# Altium schematic sheet 11_Miscellaneous.SchDoc
size A3; Engineer: Mehmet Selcuk Yayan; Organization: Procenne
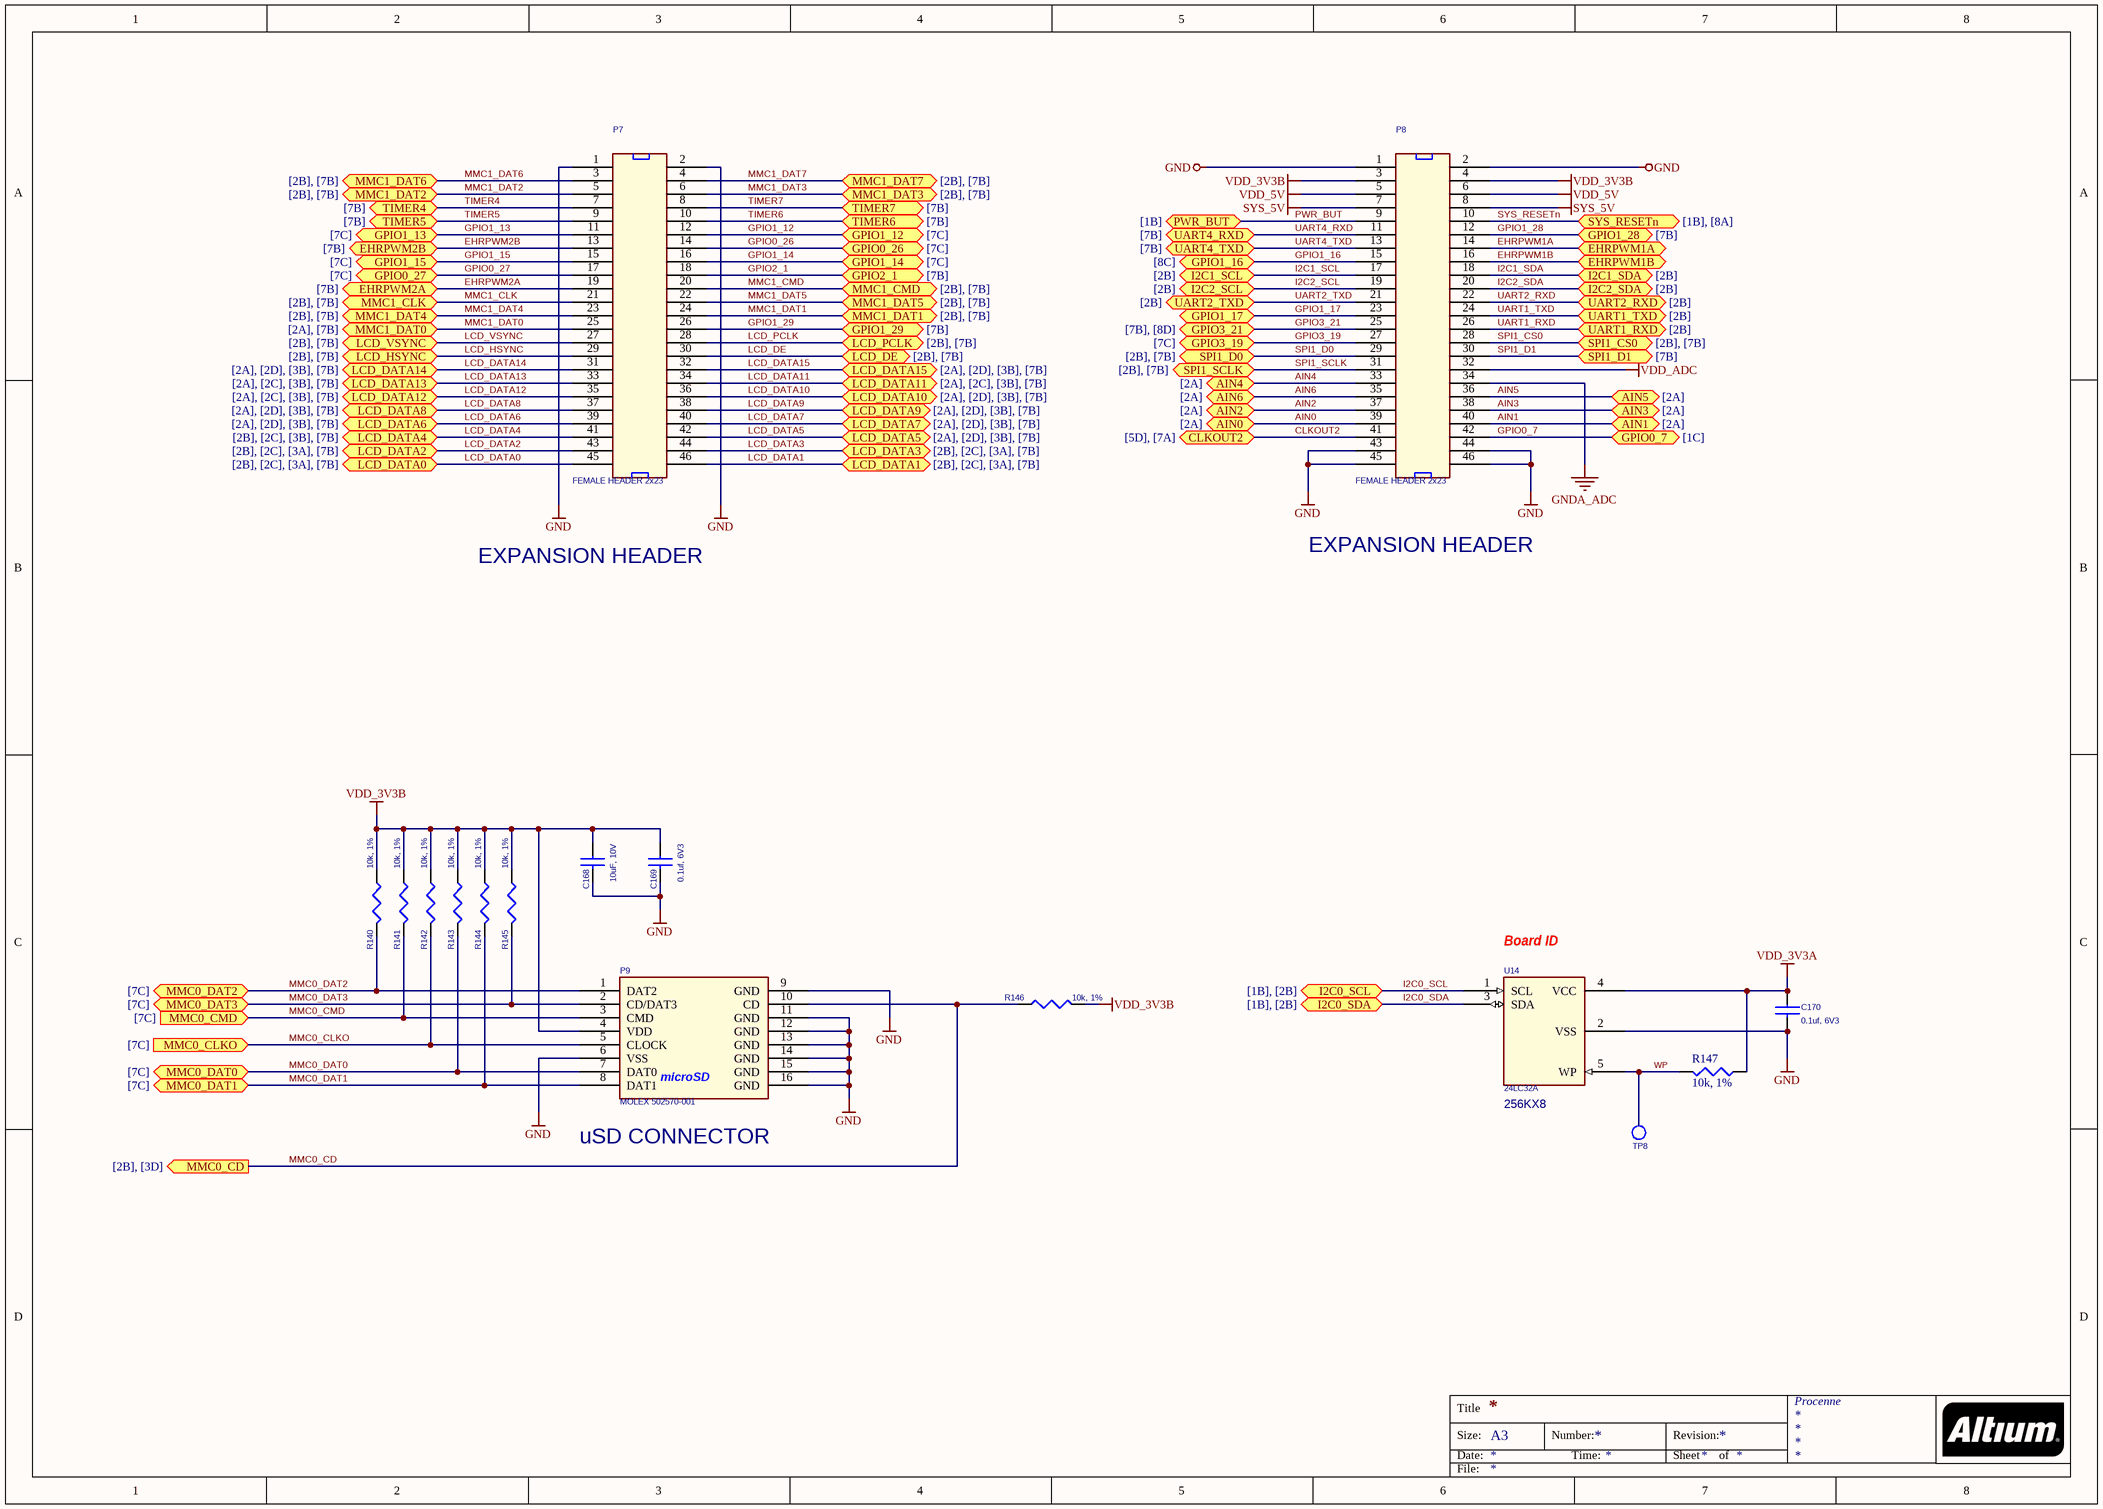
[diagram p0: 11_Miscellaneous.SchDoc]

## Parts
C168  10uF, 10V  [805]
C169  0.1uf, 6V3  [402]
C170  0.1uf, 6V3  [402]
P7  FEMALE HEADER 2x23  [HEADER23X2]
P8  FEMALE HEADER 2x23  [HEADER23X2]
P9  MOLEX 502570-001  [SD-MICRO-SCHA5B0300]
R140  10k, 1%  [402]
R141  10k, 1%  [402]
R142  10k, 1%  [402]
R143  10k, 1%  [402]
R144  10k, 1%  [402]
R145  10k, 1%  [402]
R146  10k, 1%  [402]
R147  10k, 1%  [402]
TP8  TESTPT1  [tp1-8040]  (value not drawn)  (no BOM)
U14  24LC32A  [SOT23-5]

## Ports
AIN0 (bidir, see [2A]), AIN1 (bidir, see [2A]), AIN2 (bidir, see [2A]), AIN3 (bidir, see [2A]), AIN4 (bidir, see [2A]), AIN5 (bidir, see [2A]), AIN6 (bidir, see [2A]), CLKOUT2 (bidir, see [5D], [7A]), EHRPWM1A (bidir), EHRPWM1B (bidir), EHRPWM2A (bidir, see [7B]), EHRPWM2B (bidir, see [7B]), GPIO0_7 (bidir, see [1C]), GPIO0_26 (bidir, see [7C]), GPIO0_27 (bidir, see [7C]), GPIO1_12 (bidir, see [7C]), GPIO1_13 (bidir, see [7C]), GPIO1_14 (bidir, see [7C]), GPIO1_15 (bidir, see [7C]), GPIO1_16 (bidir, see [8C]), GPIO1_17 (bidir), GPIO1_28 (bidir, see [7B]), GPIO1_29 (bidir, see [7B]), GPIO2_1 (bidir, see [7B]), GPIO3_19 (bidir, see [7C]), GPIO3_21 (bidir, see [7B], [8D]), I2C0_SCL (bidir, see [1B], [2B]), I2C0_SDA (bidir, see [1B], [2B]), I2C1_SCL (bidir, see [2B]), I2C1_SDA (bidir, see [2B]), I2C2_SCL (bidir, see [2B]), I2C2_SDA (bidir, see [2B]), LCD_DATA0 (bidir, see [2B], [2C], [3A], [7B]), LCD_DATA1 (bidir, see [2B], [2C], [3A], [7B]), LCD_DATA2 (bidir, see [2B], [2C], [3A], [7B]), LCD_DATA3 (bidir, see [2B], [2C], [3A], [7B]), LCD_DATA4 (bidir, see [2B], [2C], [3B], [7B]), LCD_DATA5 (bidir, see [2A], [2D], [3B], [7B]), LCD_DATA6 (bidir, see [2A], [2D], [3B], [7B]), LCD_DATA7 (bidir, see [2A], [2D], [3B], [7B]), LCD_DATA8 (bidir, see [2A], [2D], [3B], [7B]), LCD_DATA9 (bidir, see [2A], [2D], [3B], [7B]), LCD_DATA10 (bidir, see [2A], [2D], [3B], [7B]), LCD_DATA11 (bidir, see [2A], [2C], [3B], [7B]), LCD_DATA12 (bidir, see [2A], [2C], [3B], [7B]), LCD_DATA13 (bidir, see [2A], [2C], [3B], [7B]), LCD_DATA14 (bidir, see [2A], [2D], [3B], [7B]), LCD_DATA15 (bidir, see [2A], [2D], [3B], [7B]), LCD_DE (bidir, see [2B], [7B]), LCD_HSYNC (bidir, see [2B], [7B]), LCD_PCLK (bidir, see [2B], [7B]), LCD_VSYNC (bidir, see [2B], [7B]), MMC0_CD (out, see [2B], [3D]), MMC0_CLKO (in, see [7C]), MMC0_CMD (in, see [7C]), MMC0_DAT0 (bidir, see [7C]), MMC0_DAT1 (bidir, see [7C]), MMC0_DAT2 (bidir, see [7C]), MMC0_DAT3 (bidir, see [7C]), MMC1_CLK (bidir, see [2B], [7B]), MMC1_CMD (bidir, see [2B], [7B]), MMC1_DAT0 (bidir, see [2A], [7B]), MMC1_DAT1 (bidir, see [2B], [7B]), MMC1_DAT2 (bidir, see [2B], [7B]), MMC1_DAT3 (bidir, see [2B], [7B]), MMC1_DAT4 (bidir, see [2B], [7B]), MMC1_DAT5 (bidir, see [2B], [7B]), MMC1_DAT6 (bidir, see [2B], [7B]), MMC1_DAT7 (bidir, see [2B], [7B]), PWR_BUT (bidir, see [1B]), SPI1_CS0 (bidir, see [2B], [7B]), SPI1_D0 (bidir, see [2B], [7B]), SPI1_D1 (bidir, see [7B]), SPI1_SCLK (bidir, see [2B], [7B]), SYS_RESETn (bidir, see [1B], [8A]), TIMER4 (bidir, see [7B]), TIMER5 (bidir, see [7B]), TIMER6 (bidir, see [7B]), TIMER7 (bidir, see [7B]), UART1_RXD (bidir, see [2B]), UART1_TXD (bidir, see [2B]), UART2_RXD (bidir, see [2B]), UART2_TXD (bidir, see [2B]), UART4_RXD (bidir, see [7B]), UART4_TXD (bidir, see [7B])

## Nets
GND: C168.2 C169.2 C170.2 P7.1 P7.2 P8.1 P8.2 P8.43 P8.44 P8.45 P8.46 P9.6(VSS) P9.9(GND) P9.11(GND) P9.12(GND) P9.13(GND) P9.14(GND) P9.15(GND) P9.16(GND) U14.2(VSS)
GNDA_ADC: P8.34
SYS_5V: P8.7 P8.8
VDD_3V3A: C170.1 R147.1 U14.4(VCC)
VDD_3V3B: C168.1 C169.1 P8.3 P8.4 P9.4(VDD) R140.1 R141.1 R142.1 R143.1 R144.1 R145.1 R146.2
VDD_5V: P8.5 P8.6
VDD_ADC: P8.32
AIN0: P8.39 ; port AIN0
AIN1: P8.40 ; port AIN1
AIN2: P8.37 ; port AIN2
AIN3: P8.38 ; port AIN3
AIN4: P8.33 ; port AIN4
AIN5: P8.36 ; port AIN5
AIN6: P8.35 ; port AIN6
CLKOUT2: P8.41 ; port CLKOUT2
EHRPWM1A: P8.14 ; port EHRPWM1A
EHRPWM1B: P8.16 ; port EHRPWM1B
EHRPWM2A: P7.19 ; port EHRPWM2A
EHRPWM2B: P7.13 ; port EHRPWM2B
GPIO0_7: P8.42 ; port GPIO0_7
GPIO0_26: P7.14 ; port GPIO0_26
GPIO0_27: P7.17 ; port GPIO0_27
GPIO1_12: P7.12 ; port GPIO1_12
GPIO1_13: P7.11 ; port GPIO1_13
GPIO1_14: P7.16 ; port GPIO1_14
GPIO1_15: P7.15 ; port GPIO1_15
GPIO1_16: P8.15 ; port GPIO1_16
GPIO1_17: P8.23 ; port GPIO1_17
GPIO1_28: P8.12 ; port GPIO1_28
GPIO1_29: P7.26 ; port GPIO1_29
GPIO2_1: P7.18 ; port GPIO2_1
GPIO3_19: P8.27 ; port GPIO3_19
GPIO3_21: P8.25 ; port GPIO3_21
I2C0_SCL: U14.1(SCL) ; port I2C0_SCL
I2C0_SDA: U14.3(SDA) ; port I2C0_SDA
I2C1_SCL: P8.17 ; port I2C1_SCL
I2C1_SDA: P8.18 ; port I2C1_SDA
I2C2_SCL: P8.19 ; port I2C2_SCL
I2C2_SDA: P8.20 ; port I2C2_SDA
LCD_DATA0: P7.45 ; port LCD_DATA0
LCD_DATA1: P7.46 ; port LCD_DATA1
LCD_DATA2: P7.43 ; port LCD_DATA2
LCD_DATA3: P7.44 ; port LCD_DATA3
LCD_DATA4: P7.41 ; port LCD_DATA4
LCD_DATA5: P7.42 ; port LCD_DATA5
LCD_DATA6: P7.39 ; port LCD_DATA6
LCD_DATA7: P7.40 ; port LCD_DATA7
LCD_DATA8: P7.37 ; port LCD_DATA8
LCD_DATA9: P7.38 ; port LCD_DATA9
LCD_DATA10: P7.36 ; port LCD_DATA10
LCD_DATA11: P7.34 ; port LCD_DATA11
LCD_DATA12: P7.35 ; port LCD_DATA12
LCD_DATA13: P7.33 ; port LCD_DATA13
LCD_DATA14: P7.31 ; port LCD_DATA14
LCD_DATA15: P7.32 ; port LCD_DATA15
LCD_DE: P7.30 ; port LCD_DE
LCD_HSYNC: P7.29 ; port LCD_HSYNC
LCD_PCLK: P7.28 ; port LCD_PCLK
LCD_VSYNC: P7.27 ; port LCD_VSYNC
MMC0_CD: P9.10(CD) R146.1 ; port MMC0_CD
MMC0_CLKO: P9.5(CLOCK) R142.2 ; port MMC0_CLKO
MMC0_CMD: P9.3(CMD) R141.2 ; port MMC0_CMD
MMC0_DAT0: P9.7(DAT0) R143.2 ; port MMC0_DAT0
MMC0_DAT1: P9.8(DAT1) R144.2 ; port MMC0_DAT1
MMC0_DAT2: P9.1(DAT2) R140.2 ; port MMC0_DAT2
MMC0_DAT3: P9.2(CD/DAT3) R145.2 ; port MMC0_DAT3
MMC1_CLK: P7.21 ; port MMC1_CLK
MMC1_CMD: P7.20 ; port MMC1_CMD
MMC1_DAT0: P7.25 ; port MMC1_DAT0
MMC1_DAT1: P7.24 ; port MMC1_DAT1
MMC1_DAT2: P7.5 ; port MMC1_DAT2
MMC1_DAT3: P7.6 ; port MMC1_DAT3
MMC1_DAT4: P7.23 ; port MMC1_DAT4
MMC1_DAT5: P7.22 ; port MMC1_DAT5
MMC1_DAT6: P7.3 ; port MMC1_DAT6
MMC1_DAT7: P7.4 ; port MMC1_DAT7
PWR_BUT: P8.9 ; port PWR_BUT
SPI1_CS0: P8.28 ; port SPI1_CS0
SPI1_D0: P8.29 ; port SPI1_D0
SPI1_D1: P8.30 ; port SPI1_D1
SPI1_SCLK: P8.31 ; port SPI1_SCLK
SYS_RESETn: P8.10 ; port SYS_RESETn
TIMER4: P7.7 ; port TIMER4
TIMER5: P7.9 ; port TIMER5
TIMER6: P7.10 ; port TIMER6
TIMER7: P7.8 ; port TIMER7
UART1_RXD: P8.26 ; port UART1_RXD
UART1_TXD: P8.24 ; port UART1_TXD
UART2_RXD: P8.22 ; port UART2_RXD
UART2_TXD: P8.21 ; port UART2_TXD
UART4_RXD: P8.11 ; port UART4_RXD
UART4_TXD: P8.13 ; port UART4_TXD
WP: R147.2 TP8.1(TP) U14.5(WP)

## Notes on the sheet
- EXPANSION HEADER
- (near U14) Board ID
- (near U14) 256KX8
- (near P9) uSD CONNECTOR
- Title
- Size:
- Date:
- A3
- Number:
- Time:
- Revision:
- Sheet
- of
- File:
- (in symbol microSD_CONN_2) microSD

## Library data of the parts
C168 = CAP_10uF_Y5V_10V_10%_0805: CAP CER 10UF 10V Y5V 0805; Manufacturer: TDK Corporation; Manufacturer Part Number: C2012Y5V1A106Z; Capacitance: 10µF; Temperature Coefficient: Y5V (F); Tolerance: -20%, +80%; Applications: General Purpose; Category: Capacitors; ComponentLink1Description: http://media.digikey.com/pdf/Data%20Sheets/TDK%20PDFs/C_Series_GeneralAppl_B11.pdf; ComponentLink1URL: http://media.digikey.com/pdf/Data%20Sheets/TDK%20PDFs/C_Series_GeneralAppl_B11.pdf; Features: -; Height - Seated (Max): -; Lead Spacing: -; Lead Style: -; Mounting Type: Surface Mount, MLCC; Operating Temperature: -30°C ~ 85°C; Package / Case: 0805 (2012 Metric); Packaging: Digi-Reel®; Pricing 1: 1=0.15, 10=0.105, 100=0.0499, 250=0.042, 500=0.03518, 1000=0.02887 (USD); Ratings: -; RoHS: RoHS Compliant; Size / Dimension: 0.079" L x 0.049" W (2.00mm x 1.25mm); Stock 1: 111942; Supplier 1: Digi-Key; Supplier Part Number 1: 445-1371-6-ND; Thickness (Max): 0.057" (1.45mm); Voltage - Rated: 10V
C169 C170 = CAP_0.1uF_X7R_16V_10% 0402: CAP CER 0.1UF 6.3V 10% X5R 0402; Manufacturer: TDK Corporation; Manufacturer Part Number: C1005X5R0J104K050BA; Capacitance: 0.1µF; Supplier 1: Digi-Key; Supplier Part Number 1: 445-1266-6-ND; RoHS: RoHS Compliant; Category: Capacitors; Stock 1: 127094; Pricing 1: 1=0.1, 10=0.026, 100=0.0121, 250=0.00992, 500=0.00848, 1000=0.0066, 5000=0.0055 (USD); Voltage - Rated: 6.3V; Tolerance: ±10%; Temperature Coefficient: X5R; Mounting Type: Surface Mount, MLCC; Operating Temperature: -55°C ~ 85°C; Applications: General Purpose; Ratings: -; Package / Case: 0402 (1005 Metric); Size / Dimension: 0.039" L x 0.020" W (1.00mm x 0.50mm); Height - Seated (Max): -; Thickness (Max): 0.022" (0.55mm); Lead Spacing: -; Features: -; Packaging: Digi-Reel®; Lead Style: -; ComponentLink1URL: http://product.tdk.com/capacitor/mlcc/en/documents/mlcc_commercial_general_en.pdf; ComponentLink1Description: http://product.tdk.com/capacitor/mlcc/en/documents/mlcc_commercial_general_en.pdf
P7 P8 = HDR_46_F_2_0.1_0.1: CONN HEADER FMAL 46PS.1" DL GOLD; Manufacturer: Sullins Connector Solutions; Manufacturer Part Number: PPPC232LFBN-RC; Number of Positions: 46; Number of Positions Loaded: All; Pitch: 0.100" (2.54mm); Supplier 1: Digi-Key; Supplier Part Number 1: S7126-ND; RoHS: RoHS Compliant; Category: Connectors, Interconnects; Stock 1: 750; Pricing 1: 1=2.75, 10=2.325, 25=2.2196, 50=2.0084, 100=1.7969, 250=1.58552, 500=1.4798, 1000=1.3741, 2500=1.32125 (USD); Connector Type: Header; Contact Type: Female Socket; Number of Rows: 2; Row Spacing: 0.100" (2.54mm); Mounting Type: Through Hole; Termination: Solder; Fastening Type: -; Features: -; Contact Finish: Gold; Contact Finish Thickness: Flash; Color: Black; Packaging: Bulk; ComponentLink1URL: http://www.sullinscorp.com/drawings/78_P(N)PxCxxxLFBN-RC,_10492-G.pdf; ComponentLink1Description: http://www.sullinscorp.com/drawings/78_P(N)PxCxxxLFBN-RC,_10492-G.pdf
P9 = microSD_CONN_2: CONN MICRO SD R/A PUSH-PUSH SMD; Manufacturer: Molex Inc; Manufacturer Part Number: 5025700893; Card Type: Secure Digital - microSD™ TransFlash; Number of Positions: 10 (8 + 2); Connector Type: Connector and Ejector; Insertion, Removal Method: Push In, Push Out; Supplier 1: Digi-Key; Supplier Part Number 1: WM19093TR-ND; RoHS: RoHS Compliant; Category: Connectors, Interconnects; Stock 1: 16900; Pricing 1: 1300=2.16645, 2600=2.01703, 6500=1.94233 (USD); Ejector Side: -; Mounting Type: Surface Mount, Right Angle; Features: Switch; Height Above Board: 0.071" (1.80mm); Mounting Feature: Normal, Standard - Top; Packaging: Tape & Reel (TR); Contact Finish: Gold; Contact Finish Thickness: 20µin (0.51µm); ComponentLink1URL: http://www.molex.com/pdm_docs/sd/5025700893_sd.pdf; ComponentLink1Description: http://www.molex.com/pdm_docs/sd/5025700893_sd.pdf
R140-R147 = RES_10K_1/16W_1%_0402: RES 10K OHM 1/16W 5% 0402 SMD; Manufacturer: Rohm Semiconductor; Manufacturer Part Number: MCR01MZPJ103; Power (Watts): 0.063W, 1/16W; Temperature Coefficient: ±200ppm/°C; Category: Resistors; ComponentLink1Description: http://rohmfs.rohm.com/en/products/databook/datasheet/passive/resistor/chip_resistor/mcr_a.pdf; ComponentLink1URL: http://rohmfs.rohm.com/en/products/databook/datasheet/passive/resistor/chip_resistor/mcr_a.pdf; Composition: Thick Film; Features: Automotive AEC-Q200 Qualified; Height: 0.016" (0.40mm); Number of Terminations: 2; Package / Case: 0402 (1005 Metric); Packaging: Digi-Reel®; Pricing 1: 1=0.1, 10=0.019, 25=0.014, 100=0.0078, 250=0.00596, 500=0.00476, 1000=0.0035, 5000=0.00251 (USD); Resistance (Ohms): 10k; RoHS: RoHS Compliant; Size / Dimension: 0.039" L x 0.020" W (1.00mm x 0.50mm); Stock 1: 110842; Supplier 1: Digi-Key; Supplier Device Package: 0402 (1005 Metric); Supplier Part Number 1: RHM10KJDKR-ND; Tolerance: ±5%
U14 = 24LC32A: IC EEPROM 32KBIT 400KHZ SOT23-5; Manufacturer: Microchip Technology; Manufacturer Part Number: 24LC32AT-I/OT; Format - Memory: EEPROMs - Serial; Memory Size: 32K (4K x 8); Interface: I²C, 2-Wire Serial; Voltage - Supply: 2.5 V ~ 5.5 V; Supplier 1: Digi-Key; Supplier Part Number 1: 24LC32AT-I/OTDKR-ND; RoHS: RoHS Compliant; Category: Integrated Circuits (ICs); Stock 1: 8694; Pricing 1: 1=0.5, 10=0.32, 25=0.31, 100=0.3 (USD); Memory Type: EEPROM; Speed: 400kHz; Operating Temperature: -40°C ~ 85°C; Package / Case: SC-74A, SOT-753; Supplier Device Package: SOT-23-5; Packaging: Digi-Reel®; ComponentLink1URL: http://ww1.microchip.com/downloads/en/DeviceDoc/21713M.pdf; ComponentLink1Description: http://ww1.microchip.com/downloads/en/DeviceDoc/21713M.pdf